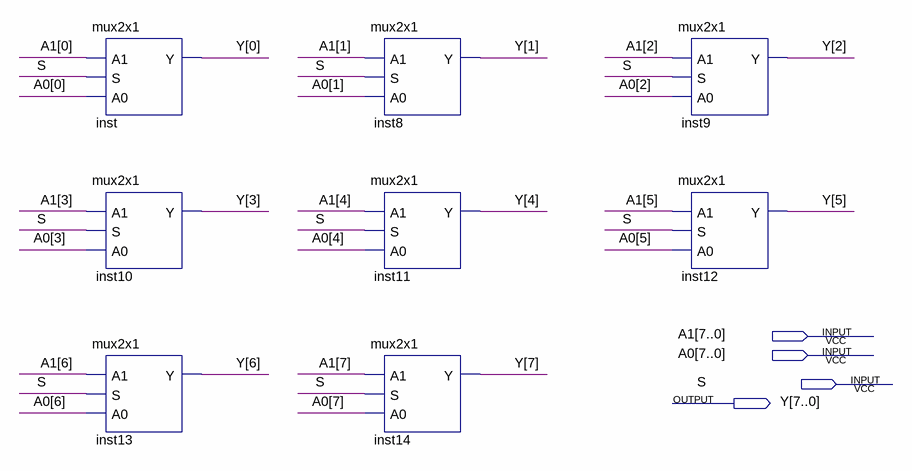
[diagram p0: schematic sheet]
// Quartus schematic mux2x8.bdf as structural Verilog: 8 symbols, 4 pins
module mux2x8 (
  input  [7:0] A1,
  input  [7:0] A0,
  input  S,
  output [7:0] Y
);

  mux2x1 inst (.A1(A1[0]), .S(S), .A0(A0[0]), .Y(Y[0]));
  mux2x1 inst10 (.A1(A1[3]), .S(S), .A0(A0[3]), .Y(Y[3]));
  mux2x1 inst13 (.A1(A1[6]), .S(S), .A0(A0[6]), .Y(Y[6]));
  mux2x1 inst8 (.A1(A1[1]), .S(S), .A0(A0[1]), .Y(Y[1]));
  mux2x1 inst11 (.A1(A1[4]), .S(S), .A0(A0[4]), .Y(Y[4]));
  mux2x1 inst14 (.A1(A1[7]), .S(S), .A0(A0[7]), .Y(Y[7]));
  mux2x1 inst9 (.A1(A1[2]), .S(S), .A0(A0[2]), .Y(Y[2]));
  mux2x1 inst12 (.A1(A1[5]), .S(S), .A0(A0[5]), .Y(Y[5]));
endmodule
